# Altium project klokun.PrjPcb
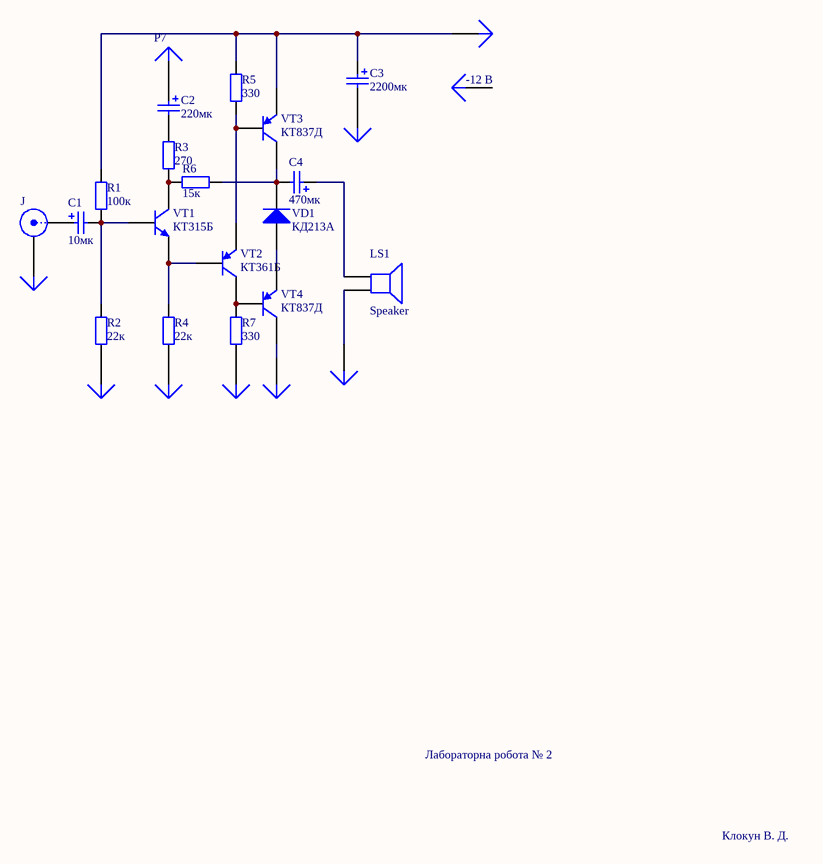
[diagram p0: klokun.SchDoc]
2 sheets, 55 parts. Net scope: global (net labels, ports and power ports of the same name join across sheets).
Board file: klokun.PcbDoc
Sheets:
  klokun.SchDoc
  klokun-custom-el.SchDoc

## Sheet klokun.SchDoc
size A4

### Parts
(Parts that share a designator on the sheet are numbered #1, #2 ... from top to bottom, then left to right.)
C1#1  value 10мк  [CAPPA14.05-10.5x6.3]  (hidden comment: Cap Pol2)
C2#1  value 220мк  [CAPPA14.05-10.5x6.3]  (hidden comment: Cap Pol2)
C3#1  value 2200мк  [CAPPA14.05-10.5x6.3]  (hidden comment: Cap Pol2)
C4#1  value 470мк  [CAPPA14.05-10.5x6.3]  (hidden comment: Cap Pol2)
J  BNC  [BNC_RA CON]  (value not drawn)
LS1  Speaker  [PIN2]
P1  Plug  [PIN1]  (value not drawn)
P2  Plug  [PIN1]  (value not drawn)
P3  Plug  [PIN1]  (value not drawn)
P4  Plug  [PIN1]  (value not drawn)
P5  Plug  [PIN1]  (value not drawn)
P6  Plug  [PIN1]  (value not drawn)
P7  Plug  [PIN1]  (value not drawn)
P8  Plug  [PIN1]  (value not drawn)
P9  Plug  [PIN1]  (value not drawn)
P10  -12 В  [PIN1]
R1#1  value 100к  [AXIAL-0.4]  (hidden comment: Res2)
R2#1  value 22к  [AXIAL-0.4]  (hidden comment: Res2)
R3#1  value 270  [AXIAL-0.4]  (hidden comment: Res2)
R4#1  value 22к  [AXIAL-0.4]  (hidden comment: Res2)
R5#1  value 330  [AXIAL-0.4]  (hidden comment: Res2)
R6#1  value 15к  [AXIAL-0.4]  (hidden comment: Res2)
R7#1  value 330  [AXIAL-0.4]  (hidden comment: Res2)
VD1  КД213А  [SMC]
VT1  КТ315Б  [TO-226]
VT2  КТ361Б  [SOT-23B]
VT3  КТ837Д  [SOT-23B]
VT4  КТ837Д  [SOT-23B]

### Nets
NetC1#1_1: C1#1.1 J.1(X)
NetC1#1_2: C1#1.2 R1#1.1 R2#1.2 VT1.2(B)
NetC2#1_1: C2#1.1 P7.1
NetC2#1_2: C2#1.2 R3#1.2
NetC3#1_1: C3#1.1 P6.1 R1#1.2 R5#1.2 VT3.3(E)
NetC3#1_2: C3#1.2 P1.1
NetC4#1_1: C4#1.1 LS1.1
NetC4#1_2: C4#1.2 R6#1.2 VD1.2(K) VT3.1(C)
NetJ_2: J.2(Y) P9.1
NetLS1_2: LS1.2 P2.1
NetP3_1: P3.1 R7#1.1
NetP4_1: P4.1 R4#1.1
NetP5_1: P5.1 R2#1.1
NetP8_1: P8.1 VT4.1(C)
NetR3#1_1: R3#1.1 R6#1.1 VT1.1(C)
NetR4#1_2: R4#1.2 VT1.3(E) VT2.2(B)
NetR5#1_1: R5#1.1 VT2.3(E) VT3.2(B)
NetR7#1_2: R7#1.2 VT2.1(C) VT4.2(B)
NetVD1_1: VD1.1(A) VT4.3(E)

Not connected (* = marked no-connect by the designer): P10 1

### Notes on the sheet
- Лабораторна робота № 2
- Клокун В. Д.

### Library data of the parts
C1#1 C2#1 C3#1 C4#1 = Cap Pol2: Polarized Capacitor (Axial); Published: 8-Jun-2000; LatestRevisionDate: 17-Jul-2002; LatestRevisionNote: Re-released for DXP Platform.; PackageReference: POLAR0.8; Publisher: Altium Limited
J = BNC: BNC Elbow Connector; LatestRevisionDate: 17-Jul-2002; LatestRevisionNote: Re-released for DXP Platform.; Publisher: Altium Limited
LS1 = Speaker: Loudspeaker; Published: 24-Mar-1999; LatestRevisionDate: 17-Jul-2002; LatestRevisionNote: Re-released for DXP Platform.; PackageReference: PIN2; Publisher: Altium Limited
P10 = Plug: LatestRevisionDate: 17-Jul-2002; LatestRevisionNote: Re-released for DXP Platform.; Publisher: Altium Limited
R1#1 R2#1 R3#1 R4#1 R5#1 R6#1 R7#1 = Res2: Resistor; Published: 8-Jun-2000; LatestRevisionDate: 17-Jul-2002; LatestRevisionNote: Re-released for DXP Platform.; PackageReference: AXIAL-0.4; Publisher: Altium Limited
VD1 = Diode: Default Diode; Published: 8-Jun-2000; LatestRevisionDate: 17-Jul-2002; LatestRevisionNote: Re-released for DXP Platform.; PackageDocument: Sep-1996; PackageReference: SMC; Publisher: Altium Limited; Code_JEDEC: DO-214-AB
VT1 = NPN: NPN Bipolar Transistor; Published: 8-Jun-2000; LatestRevisionDate: 17-Jul-2002; LatestRevisionNote: Re-released for DXP Platform.; PackageReference: TO-226; Publisher: Altium Limited; Code_JEDEC: TO-226-AA
VT2-VT4 = PNP: PNP Bipolar Transistor; Published: 8-Jun-2000; LatestRevisionDate: 17-Jul-2002; LatestRevisionNote: Re-released for DXP Platform.; PackageReference: SOT-23B; Publisher: Altium Limited; Code_JEDEC: SOT-23
P1-P9 = Plug: LatestRevisionDate: 17-Jul-2002; LatestRevisionNote: Re-released for DXP Platform.; Publisher: Altium Limited

## Sheet klokun-custom-el.SchDoc
size A4
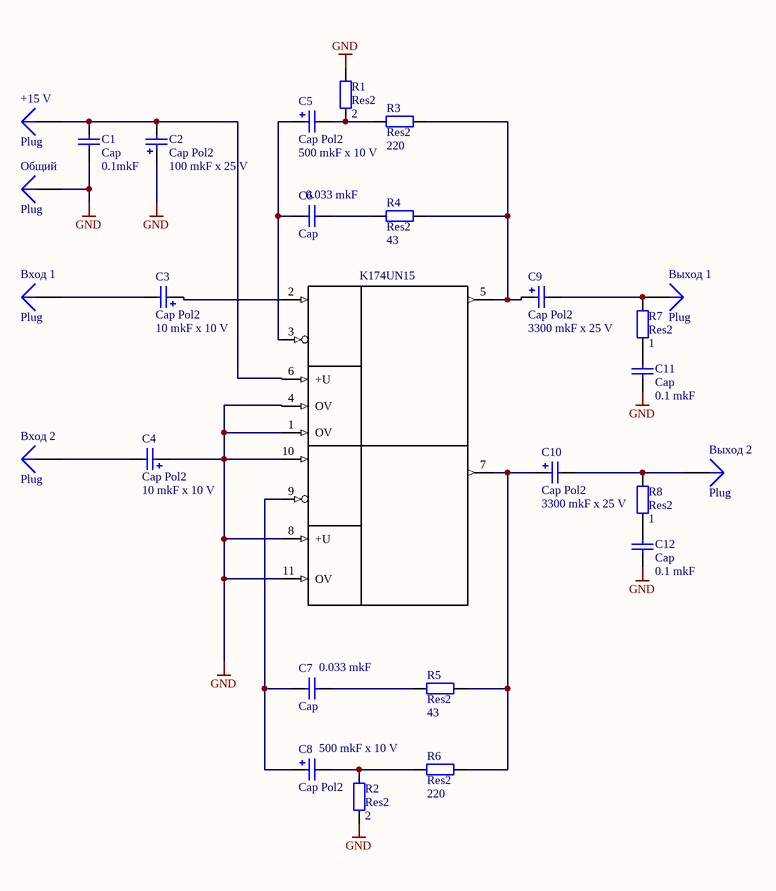
[diagram p1: klokun-custom-el.SchDoc]

### Parts
(Parts that share a designator on the sheet are numbered #1, #2 ... from top to bottom, then left to right.)
+15_V  Plug  [PIN1]
C1#2  Cap  value 0.1mkF  [RAD-0.3]
C2#2  Cap Pol2  value 100 mkF x 25 V  [POLAR0.8]
C3#2  Cap Pol2  value 10 mkF x 10 V  [POLAR0.8]
C4#2  Cap Pol2  value 10 mkF x 10 V  [POLAR0.8]
C5  Cap Pol2  value 500 mkF x 10 V  [POLAR0.8]
C6  Cap  value 0.033 mkF  [RAD-0.3]
C7  Cap  value 0.033 mkF  [RAD-0.3]
C8  Cap Pol2  value 500 mkF x 10 V  [POLAR0.8]
C9  Cap Pol2  value 3300 mkF x 25 V  [POLAR0.8]
C10  Cap Pol2  value 3300 mkF x 25 V  [POLAR0.8]
C11  Cap  value 0.1 mkF  [RAD-0.3]
C12  Cap  value 0.1 mkF  [RAD-0.3]
DA1  K174UN15
R1#2  Res2  value 2  [AXIAL-0.4]
R2#2  Res2  value 2  [AXIAL-0.4]
R3#2  Res2  value 220  [AXIAL-0.4]
R4#2  Res2  value 43  [AXIAL-0.4]
R5#2  Res2  value 43  [AXIAL-0.4]
R6#2  Res2  value 220  [AXIAL-0.4]
R7#2  Res2  value 1  [AXIAL-0.4]
R8  Res2  value 1  [AXIAL-0.4]
Вход_1  Plug  [PIN1]
Вход_2  Plug  [PIN1]
Выход_1  Plug  [PIN1]
Выход_2  Plug  [PIN1]
Общий  Plug  [PIN1]

### Nets
GND: C1#2.1 C2#2.1 C4#2.1 C11.1 C12.1 DA1.1(OV) DA1.4(OV) DA1.8(+U) DA1.10 DA1.11(OV) R1#2.2 R2#2.1 Общий.1
Net+15_V_1: +15_V.1 C1#2.2 C2#2.2 DA1.6(+U)
NetC3#2_1: C3#2.1 DA1.2
NetC3#2_2: C3#2.2 Вход_1.1
NetC4#2_2: C4#2.2 Вход_2.1
NetC5_1: C5.1 C6.1 DA1.3
NetC5_2: C5.2 R1#2.1 R3#2.1
NetC6_2: C6.2 R4#2.1
NetC7_1: C7.1 C8.1 DA1.9
NetC7_2: C7.2 R5#2.1
NetC8_2: C8.2 R2#2.2 R6#2.1
NetC9_1: C9.1 DA1.5 R3#2.2 R4#2.2
NetC9_2: C9.2 R7#2.2 Выход_1.1
NetC10_1: C10.1 DA1.7 R5#2.2 R6#2.2
NetC10_2: C10.2 R8.2 Выход_2.1
NetC11_2: C11.2 R7#2.1
NetC12_2: C12.2 R8.1

### Library data of the parts
C1#2 C6 C7 C11 C12 = Cap: Capacitor; Published: 8-Jun-2000; LatestRevisionDate: 17-Jul-2002; LatestRevisionNote: Re-released for DXP Platform.; PackageReference: RAD-0.3; Publisher: Altium Limited
C2#2 C3#2 C4#2 C5 C8-C10 = Cap Pol2: Polarized Capacitor (Axial); Published: 8-Jun-2000; LatestRevisionDate: 17-Jul-2002; LatestRevisionNote: Re-released for DXP Platform.; PackageReference: POLAR0.8; Publisher: Altium Limited
R1#2 R2#2 R3#2 R4#2 R5#2 R6#2 R7#2 R8 = Res2: Resistor; Published: 8-Jun-2000; LatestRevisionDate: 17-Jul-2002; LatestRevisionNote: Re-released for DXP Platform.; PackageReference: AXIAL-0.4; Publisher: Altium Limited
+15_V Вход_1 Вход_2 Выход_1 Выход_2 Общий = Plug: LatestRevisionDate: 17-Jul-2002; LatestRevisionNote: Re-released for DXP Platform.; Publisher: Altium Limited
DA1 = K174UN15: ComponentName: K174UN15